# EasyEDA Pro project WS51F640_ISP_CH552G.epro

# Schematic Schematic1
Board Name: Board1; Create Date: 2026-07-01; Page Name: P1; Project Name: WS51F640_ISP_CH552; Schematic Name: Schematic1; Update Date: 2026-07-02; Company: EasyEDA.com; Page Size: A4; Version: V1.0
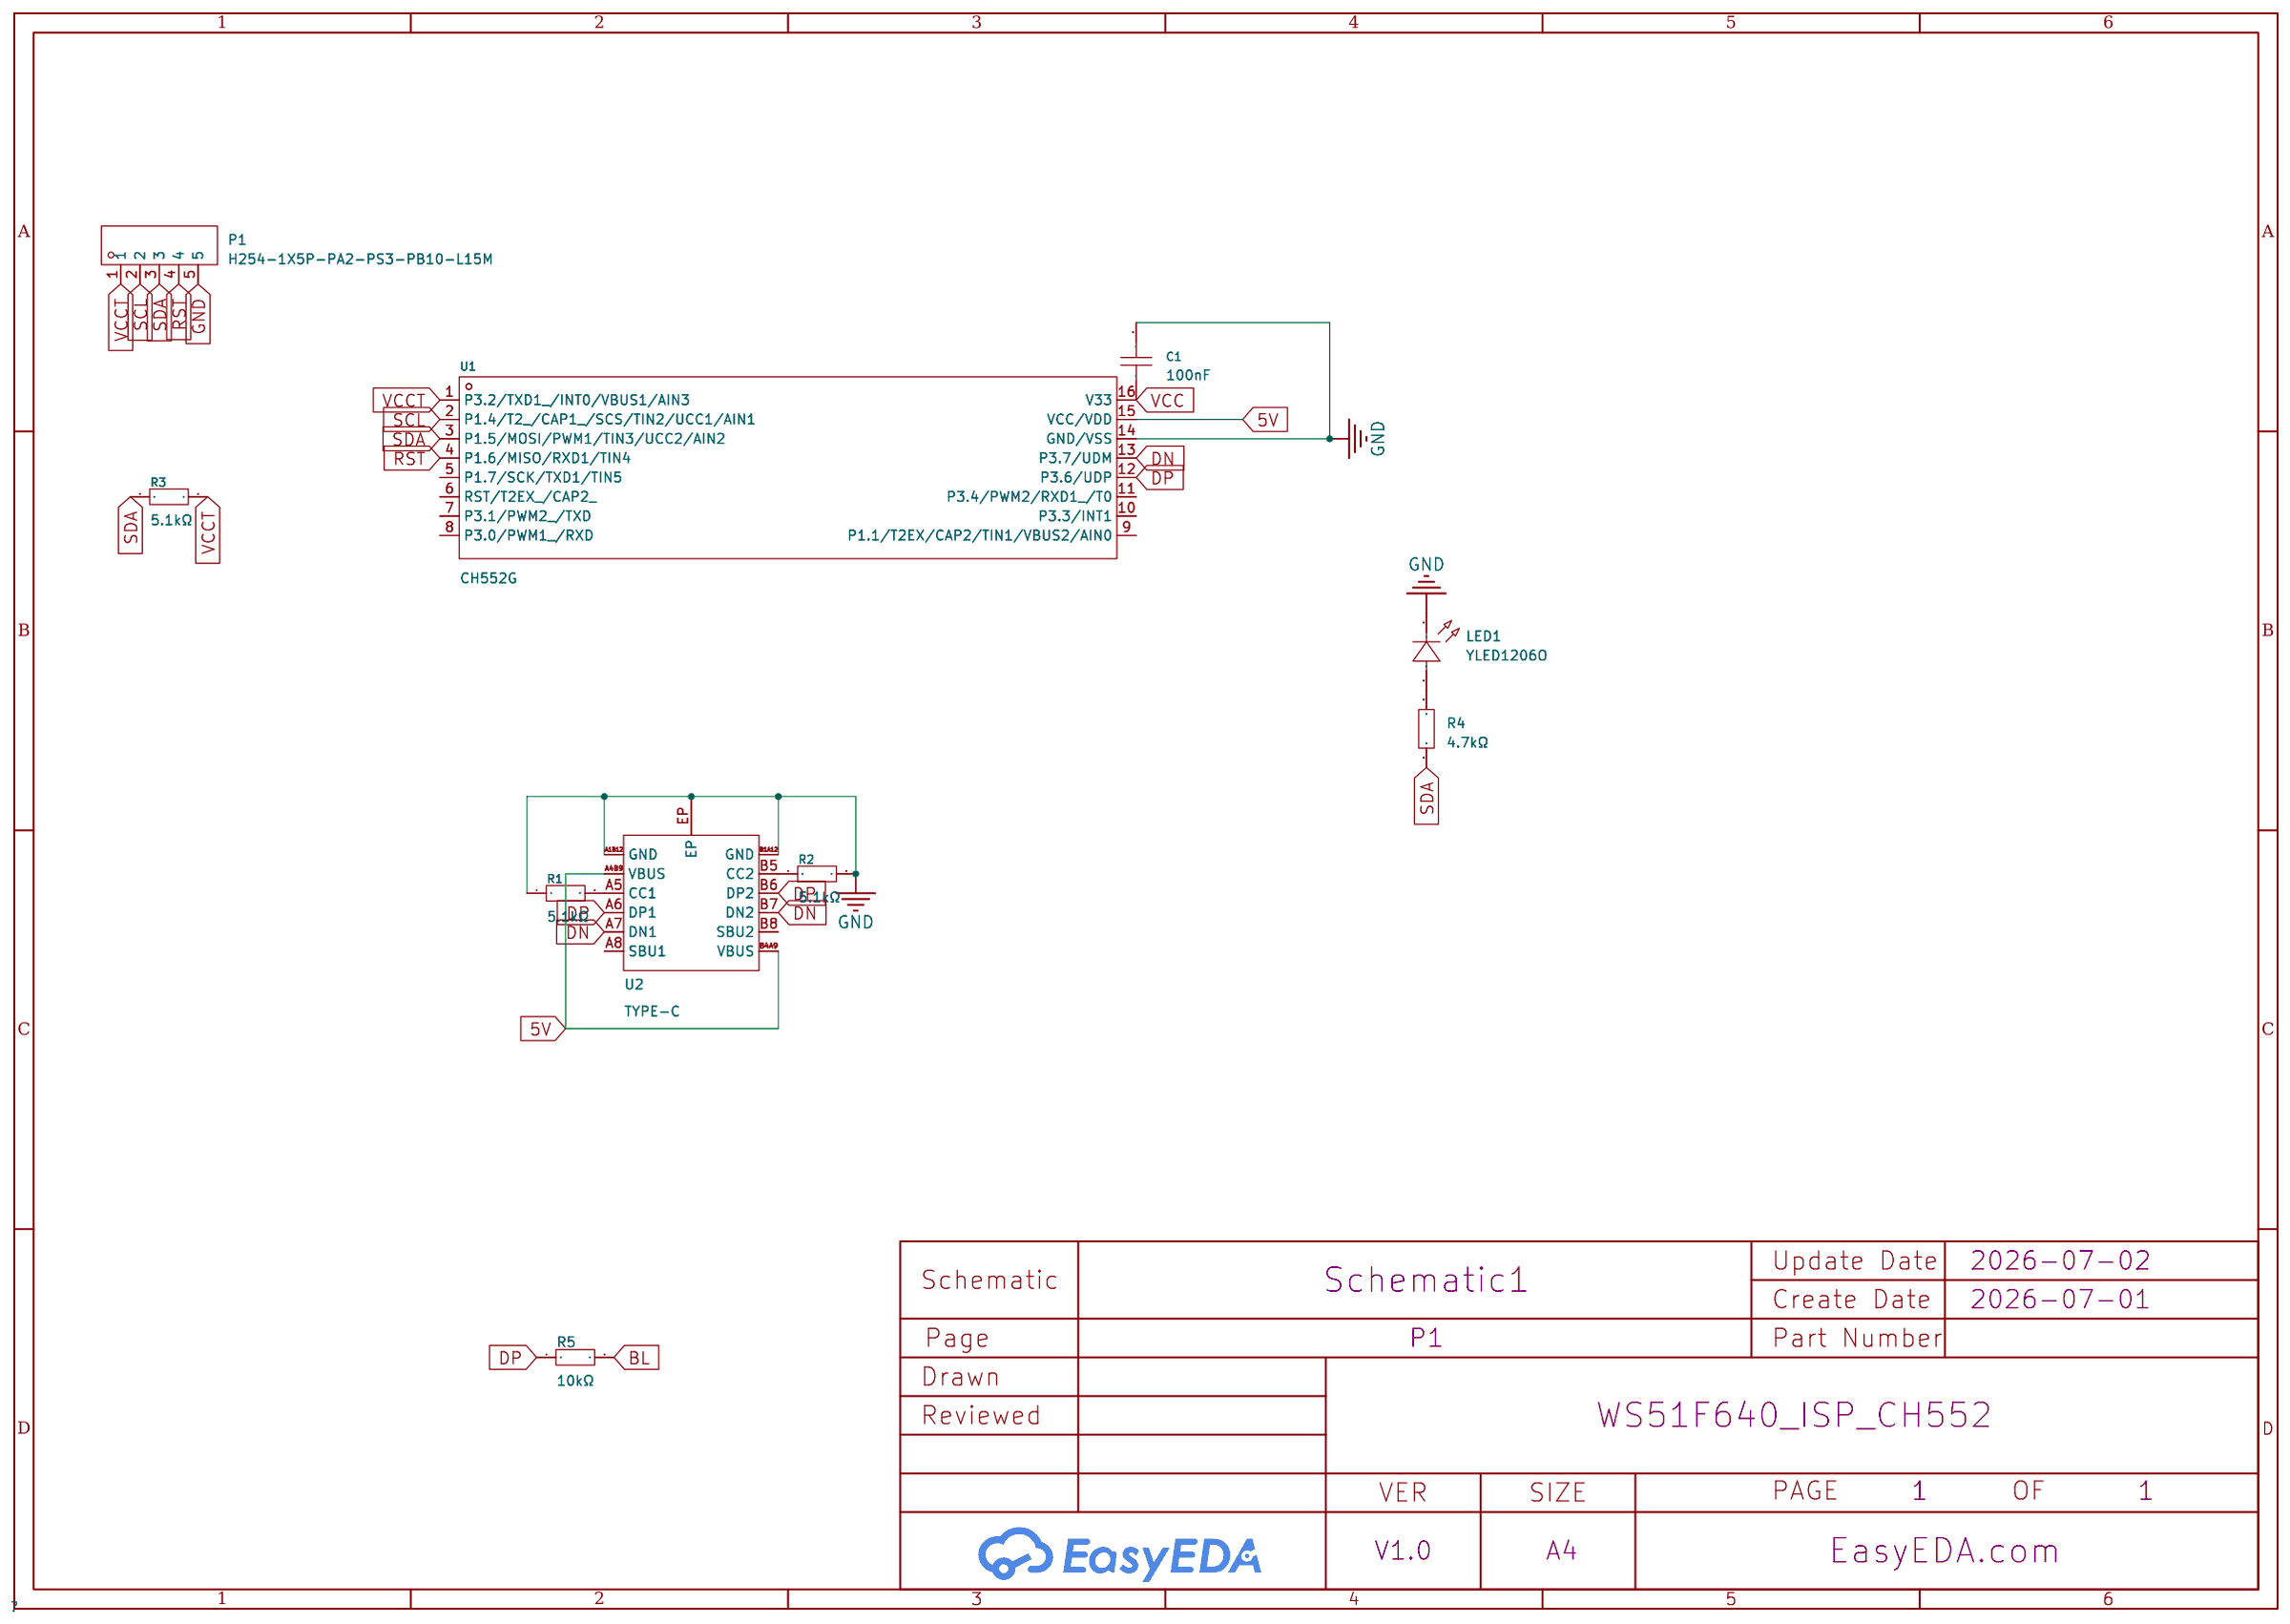
[diagram p0: schematic sheet]

## Parts
C1  100nF  [C1206]
LED1  YLED1206O  [LED1206-RD]
P1  H254-1X5P-PA2-PS3-PB10-L15M  [HDR-TH_5P-P2.54-V-M]
R1  5.1kΩ  [R1206]
R2  5.1kΩ  [R1206]
R3  5.1kΩ  [R1206]
R4  4.7kΩ  [R1206]
R5  10kΩ  [R1206]
U1  CH552G  [SOP-16_L10.0-W3.9-P1.27-LS6.0-BL]
U2  TYPE-C  [USB-C-SMD_TYPE-C-16P-1]

## Library data of the parts
C1 = C1206C104K5RAC7800: Capacitance:100nF Tolerance:±10% Tolerance:±10% Voltage Rating:50V Temperature Coefficient:X7R; LCSC Part Name: 100nF ±10% 50V; Supplier Part: C141184; Manufacturer: KEMET(基美); Supplier Footprint: 1206; JLCPCB Part Class: Extended Part; Datasheet: https://item.szlcsc.com/datasheet/C1206C104K5RAC7800/152514.html; Supplier: LCSC; Tolerance: ±10%; Voltage Rating: 50V; Temperature Coefficient: X7R
LED1 = YLED1206O: Lamp Holder Type:- Illumination Color:Orange Voltage - Forward(Vf):1.8V~2.4V Voltage - Forward(Vf):1.8V~2.4V Power(Watts):48mW Forward Current:20mA Wavelength - Dominant:598nm~608nm Wavelength - Dominant:598nm~608nm Peak Wavelength:612nm Peak Wavelength:6; LCSC Part Name: 发光管; Supplier Part: C28310440; Manufacturer: YONGYUTAI(永裕泰); Supplier Footprint: 1206; JLCPCB Part Class: Extended Part; Datasheet: https://item.szlcsc.com/datasheet/YLED1206O/30046767.html; Supplier: LCSC; Illumination Color: Orange; Voltage - Forward(Vf): 1.8V~2.4V; Power(Watts): 48mW; Forward Current: 20mA; Wavelength - Dominant: 598nm~608nm; Peak Wavelength: 612nm; Diode Configuration: Discrete Diode; Lens Color: Water Clear; Luminous Intensity: 175mcd; Viewing Angle: 120°; Operating Temperature: -40℃~+85℃
P1 = H254-1X5P-PA2-PS3-PB10-L15M: Supplier Part: C9900166203; Supplier Footprint: 插件,P=2.54mm; JLCPCB Part Class: Extended Part; Supplier: LCSC
R1-R3 = RS-06K512FT: Type:Thick Film Resistors Resistance:5.1kΩ Tolerance:±1% Tolerance:±1% Power(Watts): Temperature Coefficient:±100ppm/℃ Temperature Coefficient:±100ppm/℃; LCSC Part Name: 厚膜电阻 5.1kΩ ±1% 250mW 停产; Supplier Part: C304898; Manufacturer: FH(风华); Supplier Footprint: 1206; JLCPCB Part Class: Extended Part; Datasheet: https://atta.szlcsc.com/upload/public/pdf/source/20190505/C118335_36085569433BA7FFC796E569DBFE3139.pdf; Supplier: LCSC; Type: Thick Film Resistors; Tolerance: ±1%; Temperature Coefficient: ±100ppm/℃
R4 = RS-06K472FT: Type:Thick Film Resistors Resistance:4.7kΩ Tolerance:±1% Tolerance:±1% Power(Watts): Temperature Coefficient:±100ppm/℃ Temperature Coefficient:±100ppm/℃; LCSC Part Name: 厚膜电阻 4.7kΩ ±1% 250mW; Supplier Part: C304895; Manufacturer: FH(风华); Supplier Footprint: 1206; JLCPCB Part Class: Extended Part; Datasheet: https://atta.szlcsc.com/upload/public/pdf/source/20190505/C118335_36085569433BA7FFC796E569DBFE3139.pdf; Supplier: LCSC; Type: Thick Film Resistors; Tolerance: ±1%; Temperature Coefficient: ±100ppm/℃
R5 = CR1206F41002G: Type:Thick Film Resistors Resistance: Tolerance:±1% Tolerance:±1% Power(Watts): Overload Voltage (Max): Temperature Coefficient:±100ppm/℃ Temperature Coefficient:±100ppm/℃ Operating Temperature Range:-55℃~+125℃ Operating Temperature Range:-55℃~+125℃; LCSC Part Name: 厚膜电阻 10kΩ ±1% 250mW; Supplier Part: C102061; Manufacturer: LIZ(丽智电子); Supplier Footprint: 1206; JLCPCB Part Class: Extended Part; Datasheet: https://atta.szlcsc.com/upload/public/pdf/source/20180403/C189438_6D658388CC7843F35BBC9018D03F0B8E.pdf; Supplier: LCSC; Type: Thick Film Resistors; Tolerance: ±1%; Temperature Coefficient: ±100ppm/℃; Operating Temperature Range: -55℃~+125℃
U1 = CH552G: CPU Core:51 Series CPU Maximum Speed:24MHz Program Storage Size:16KB Program Memory Type:FLASH ADC (Bit):8bit PWM (Bit):8bit Voltage - Supply:3.3V~5V Voltage - Supply:3.3V~5V Applications:-; LCSC Part Name: 8位增强型USB单片机; Supplier Part: C111292; Manufacturer: WCH(南京沁恒); Supplier Footprint: SOP-16; JLCPCB Part Class: Extended Part; Datasheet: https://item.szlcsc.com/datasheet/CH552G/112518.html; Supplier: LCSC; CPU Core: 51 Series; CPU Maximum Speed: 24MHz; Program Storage Size: 16KB; Program Memory Type: FLASH; ADC (Bit): 8bit; PWM (Bit): 8bit; Voltage - Supply: 3.3V~5V
U2 = TYPE-C_C9900008394: Supplier Part: C9900008394; Supplier Footprint: TYPE-C-16P; JLCPCB Part Class: Extended Part; Supplier: LCSC

## Nets
5V: U1.15(VCC/VDD) U2.A4B9(VBUS) U2.B4A9(VBUS)
GND: C1.2 LED1.1(K) P1.5 R1.1 R2.2 U1.14(GND/VSS) U2.A1B12(GND) U2.B1A12(GND) U2.EP
VCC: C1.1 U1.16(V33)
VCCT: P1.1 R3.2 U1.1(P3.2/TXD1_/INT0/VBUS1/AIN3)
BL: R5.2
DN: U1.13(P3.7/UDM) U2.A7(DN1) U2.B7(DN2)
DP: R5.1 U1.12(P3.6/UDP) U2.A6(DP1) U2.B6(DP2)
RST: P1.4 U1.4(P1.6/MISO/RXD1/TIN4)
SCL: P1.2 U1.2(P1.4/T2_/CAP1_/SCS/TIN2/UCC1/AIN1)
SDA: P1.3 R3.1 R4.1 U1.3(P1.5/MOSI/PWM1/TIN3/UCC2/AIN2)
$1N387: R1.2 U2.A5(CC1)
$1N424: R2.1 U2.B5(CC2)
$1N1207: LED1.2(A) R4.2

Not connected (* = marked no-connect by the designer): U1 5(P1.7/SCK/TXD1/TIN5) 6(RST/T2EX_/CAP2_) 7(P3.1/PWM2_/TXD) 8(P3.0/PWM1_/RXD) 9(P1.1/T2EX/CAP2/TIN1/VBUS2/AIN0) 10(P3.3/INT1) 11(P3.4/PWM2/RXD1_/T0); U2 A8(SBU1) B8(SBU2)

# Board PCB1
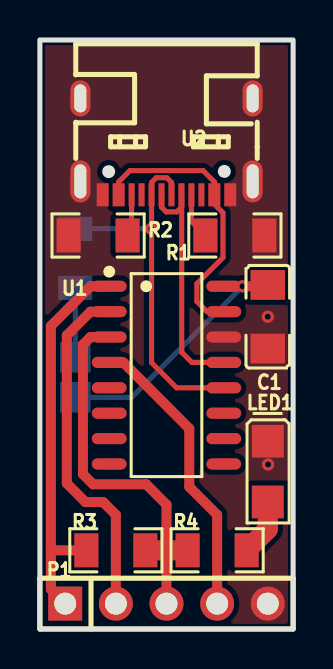
[diagram p1: board, top side]
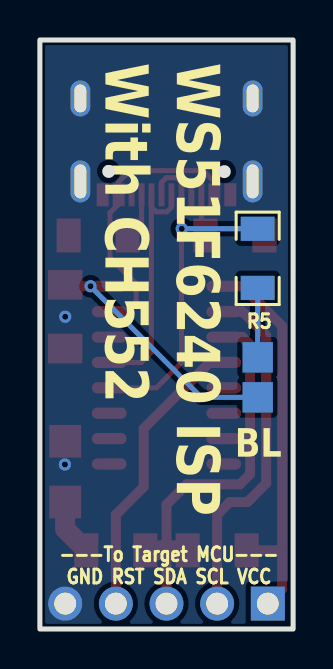
[diagram p2: board, bottom side, seen from below]

Outline 12.7 x 29.46 mm; copper layers: Top Layer, Bottom Layer. Coordinates in mm from the lower left corner of the outline.
Outline path: rectangle 0,29.46 12.7,0
Stack: Top Layer 0.035mm / Dielectric1 1.51mm FR4 er 4.5 / Bottom Layer 0.035mm

## Design rules (mm)
template: 自定义配置
spacing copperThickness1oz (default): track to track 0.102, other pairs 0.152 to 0.3
spacing copperThickness2oz: track to track 0.203, other pairs 0.152 to 0.3
track width copperThickness1oz (default): min 0.127, default 0.254, max 2.54
track width copperThickness2oz: min 0.203, default 0.254, max 2.54
differential pair differentialPair (default): width min 0.127, default 0.254, max 2.54; gap min 0.152, default 0.152
via viaSize (default): diameter min 0.5, default 0.61, max 10; hole min 0.3, default 0.305, max 6.3

## Placement (name value [footprint] x y rotation side)
C1  100nF  [C1206]  11.43 15.62 270 top
LED1  YLED1206O  [LED1206-RD]  11.43 7.87 270 top
NOREF  -  [Pad_e496]  1.78 13.59 0 top
NOREF#2  -  [Pad_e497]  1.78 11.59 0 top
P1  H254-1X5P-PA2-PS3-PB10-L15M  [HDR-TH_5P-P2.54-V-M]  6.35 1.27 0 top
R1  5.1kΩ  [R1206]  9.78 19.69 180 top
R2  5.1kΩ  [R1206]  2.92 19.69 180 top
R3  5.1kΩ  [R1206]  3.81 3.94 180 top
R4  4.7kΩ  [R1206]  8.89 3.94 0 top
R5  10kΩ  [R1206]  1.78 18.54 270 bottom
U1  CH552G  [SOP-16_L10.0-W3.9-P1.27-LS6.0-BL]  6.35 12.7 270 top
U2  TYPE-C  [USB-C-SMD_TYPE-C-16P-1]  6.35 24.13 180 top

## Footprints (pads in the part's own frame, mm; a bottom-side part is the same pattern mirrored in y, then rotated)
C1206
  rect 1.485x1.728 smd: 1(-1.593,0) 2(1.593,0)
HDR-TH_5P-P2.54-V-M
  rect 1.7x1.7 hole 1.1: 1(-5.08,0)
  round 1.7 hole 1.1: 2(-2.54,0) 3(0,0) 4(2.54,0) 5(5.08,0)
LED1206-RD
  rect 1.635x1.6 smd: 1(-1.518,0) 2(1.518,0)
Pad_e496
  rect 1.524x1.524 smd far side: 1(0,0)
Pad_e497
  rect 1.524x1.524 smd far side: 2(0,0)
R1206
  rect 1.208x1.701 smd: 1(-1.479,0) 2(1.479,0)
SOP-16_L10.0-W3.9-P1.27-LS6.0-BL
  oval 0.56x1.745 smd: 1(-4.445,-2.873) 2(-3.175,-2.873) 3(-1.905,-2.873) 4(-0.635,-2.873) 5(0.635,-2.873) 6(1.905,-2.873) 7(3.175,-2.873) 8(4.445,-2.873) 9(4.445,2.873) 10(3.175,2.873) 11(1.905,2.873) 12(0.635,2.873) 13(-0.635,2.873) 14(-1.905,2.873) 15(-3.175,2.873) 16(-4.445,2.873)
USB-C-SMD_TYPE-C-16P-1
  rect 0.6x1.15 smd: A1B12(-3.2,2.41) A4B9(-2.4,2.41) B1A12(3.2,2.41) B4A9(2.4,2.41)
  rect 0.3x1.15 smd: A5(-1.25,2.41) A6(-0.25,2.41) A7(0.25,2.41) A8(1.25,2.41) B5(1.75,2.41) B6(0.75,2.41) B7(-0.75,2.41) B8(-1.75,2.41)
  oval 1x2.1 hole 0.6x1.7: EP(-4.32,1.74) EP(4.32,1.74)
  oval 1x1.8 hole 0.6x1.4: EP(-4.32,-2.41) EP(4.32,-2.41)

## Nets
As in the schematic, except:
VCC: C1.1 NOREF#2.2 U1.16
BL: NOREF.1 R5.2

Pads without a net: U1 5 6 7 8 9 10 11; U2 A8 B8

## Via types
v1: diameter 0.61, hole 0.305, Top Layer to Bottom Layer, 4 vias

## Routing (per net, layer and track width the routed paths; a pad name or vN(x,y) marks a point on that pad's centre or on a via; arc(x,y) is an arc through that point)
5V: length 14.2
  Top Layer w0.254: U2.B4A9 3.95,22.37 4.51,22.93 8.19,22.93 8.76,22.35 8.76,21.73 U2.A4B9 8.75,21.25 9.18,20.82 9.18,18.58 7.87,17.27 7.87,16.38 8.38,15.88 U1.15
GND:
  vias: v1(11.43,15.62) v1(11.44,8.23)
VCC: length 12.9
  Top Layer w0.5: U1.16 v1(10.16,17.15) 11.36,17.15 C1.1
  Bottom Layer w0.254: v1(10.16,17.15) 4.6,11.59 NOREF#2.2
VCCT: length 19.8
  Top Layer w0.5: U1.1 2.54,17.15 0.55,15.16 0.55,3.99 ; 0.55,3.99 0.68,3.99 0.62,3.94 R3.2 ; 0.55,3.99 0.55,1.99 P1.1
BL: length 3.5
  Bottom Layer w0.254: NOREF.1 R5.2
DN: length 12
  Top Layer w0.254: 7.11,21.11 7.11,13.84 7.62,13.34 U1.13 ; 7.11,21.11 6.87,20.87 6.33,20.87 6.1,21.1 U2.A7 ; 7.11,21.11 7.11,21.71 U2.B7
DP: length 18.8
  Top Layer w0.254: U2.A6 6.6,21.72 6.6,22.34 6.37,22.57 5.83,22.57 5.6,22.34 U2.B6 5.6,13.32 6.86,12.06 U1.12
  Bottom Layer w0.254: R5.1 v1(5.59,20.02)
RST: length 14.7
  Top Layer w0.5: U1.4 4.18,13.34 7.49,10.03 7.49,7.11 8.89,5.72 P1.4
SCL: length 17.6
  Top Layer w0.5: U1.2 2.54,15.88 1.35,14.69 1.35,7.29 2.29,6.35 3.17,6.35 3.81,5.72 P1.2
SDA: length 19.9
  Top Layer w0.5: P1.3 6.35,6.22 5.33,7.24 2.67,7.24 2.16,7.75 2.16,14.22 2.54,14.61 U1.3
  Top Layer w1: R3.1 R4.1
$1N387: length 2.3
  Top Layer w0.254: U2.A5 7.6,20.39 R1.2
$1N424: length 2.1
  Top Layer w0.254: R2.1 4.6,19.89 U2.B5
$1N1207: length 2.9
  Top Layer w1: R4.2 11.43,5 LED1.2

## Copper pours and planes (outline as drawn; the poured copper is in the pictures)
GND on Top Layer: 0,29.46 12.7,29.46 12.7,0 0,0
GND on Bottom Layer: 0,29.46 12.7,29.46 12.7,0 0,0

## Text on the board
Bottom Silkscreen Layer: ---To Target MCU--- / GND RST SDA SCL VCC | BL | WS51F6240 ISP / With CH552
